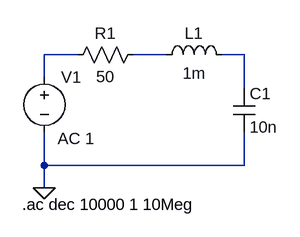
[diagram p0: schematic Circuito4.asc]
Circuito4.asc, the LTspice schematic file:
Version 4
SHEET 1 880 680
WIRE 32 80 -16 80
WIRE 160 80 112 80
WIRE 272 80 240 80
WIRE -16 112 -16 80
WIRE 272 128 272 80
WIRE -16 240 -16 192
WIRE 272 240 272 192
WIRE 272 240 -16 240
WIRE -16 272 -16 240
FLAG -16 272 0
SYMBOL voltage -16 96 R0
WINDOW 123 19 105 Left 2
WINDOW 39 0 0 Left 0
SYMATTR InstName V1
SYMATTR Value ""
SYMATTR Value2 AC 1
SYMBOL res 128 64 R90
WINDOW 0 0 56 VBottom 2
WINDOW 3 32 56 VTop 2
SYMATTR InstName R1
SYMATTR Value 50
SYMBOL ind 144 96 R270
WINDOW 0 32 56 VTop 2
WINDOW 3 5 56 VBottom 2
SYMATTR InstName L1
SYMATTR Value 1m
SYMBOL cap 256 128 R0
SYMATTR InstName C1
SYMATTR Value 10n
TEXT -48 296 Left 2 !.ac dec 10000 1 10Meg

The netlist it stands for:
* Circuito4.asc
V1 N001 0 AC 1
R1 N002 N001 50
L1 N002 N003 1m
C1 N003 0 10n
.ac dec 10000 1 10Meg
.backanno
.end